# Altium schematic sheet 5V_to_3v3_LDO.SchDoc
size A4; SheetNumber: 1; SheetTotal: 1; SPICEModelCacheJSIICOIN: <root> / <DocumentId>JSIICOIN</DocumentId> / <CacheFrame Number="0"> / <Model Name="tps79301_trans" Kind="CKT"> / <Text>**$ENCRYPTED_LIB / **$INTERFACE / * PSpice Model Editor - Version 16.2.0 / *$ / * TPS79301 / ***************************************************************************** / * (C) Copyright 2014 Texas Instruments Incorporated. All rights reserved. / ***************************************************************************** / ** This model is designed as an aid for customers of Texas Instruments. / ** TI and its licensors and suppliers make no warranties, either expressed / ** or implied, with respect to this model, including the warranties of / ** merchantability or fitness for a particular purpose. The model is / ** provided solely on an "as is" basis. The entire risk as to its quality / ** and performance is with the customer / ***************************************************************************** / * / ** Released by: WEBENCH Design Center, Texas Instruments Inc. / * Part: TPS79301 / * Date: 15MAR2014 / * Model Type: Transient / * Simulator: PSPICE / * Simulator Version: 16.2.0.p001 / * EVM Order Number: / * EVM Users Guide:SLVU060A / * Datasheet:SLVS348K-JULY 2001-REVISED OCTOBER 2007 / * / * Model Version: Final 1.00 / * / ***************************************************************************** / * / * Updates: / * / * Final 1.00 / * Release to Web / * / ***************************************************************************** / .SUBCKT TPS79301_TRANS  EN FB IN NR OUT GND / $CDNENCSTART / eee8c5c7a2bc4b01f045f303678664e7916da0bae22e8cb0bba041dd67c69ce448ea70148a9ac1670c8926c1ac5057c8ccfcd77bf87ca9dc19aba5d812fba493 / e83d563d614d5ce9e51c6191fdee4cd4bce2d2dc11b96d0f837145b8adc33a658601dbab3ff30b84da2786fb28e183da6e95518d223f2ab2788d9cae4bb17f9a / 705d459f50f7a08caf1922b60cad7ad54cb34a6f6f4f982a83463dd640f012e5fa5c51fb57f6720834a9ff988247e80f7ceed9c0dd1315b72a5cba85944eb4fa / a5d158a0fc11634f706b807646b80371c9da099ce416dcb0d32ee1f27e0d56e381a4e64a33303cd14d5f52b18455b172772a154286059e76b1f4ddde2fe1d73b / 69ff18044fae7c89706b807646b8037173658656f6f1dced3d1d674018caacf76620fcb51151ae8a7f84b3e8dbca604066f166a62e9bfcac9633a999d416b399 / 1ac3d64a7ec42565706b807646b80371149ac564803ab67fc1c637a7619feb26064adbd3d20689e2cb54280b4e1f8a033c858dbd7e6e5120e4e72beed32b1f99 / 5911b2e9db27761730769f98cd129b1534a9ff988247e80f7ceed9c0dd1315b7d1a8fcda4803698e63ad4c3b7449453463c00aabea44dc2dd8dcbfbde6d9d2b2 / bbf0a766f49a242c2637e9cac2aa5cea2cecad1ebf804c4b2473511ee33aa3b97f84b3e8dbca604066f166a62e9bfcac2681eeb8fe6ce8909bec96d9b1f39191 / e9f419af62bfe95ecc0121b5e20e2076c72e677679789a89508e95ff7173491c9f7df7e1d8537137763d73e9d3a8d5e0dfe5c6a8bc6238bfe91723734fcf8610 / 0a74212461f65cb92e1bbe5dba9805b5cb82e1066e82af78661c6c5a6c3f664f7f84b3e8dbca604066f166a62e9bfcac2681eeb8fe6ce8909bec96d9b1f39191 / bc8ee2299b220803f4a59b3893f03200ff7f90e051f04fa3cf5e9389f2a48e3c7f84b3e8dbca604066f166a62e9bfcac2681eeb8fe6ce8909bec96d9b1f39191 / 22cc75479b3d980a706b807646b80371c9da099ce416dcb0978b3e87ef4193663a8d0e744922d2c29852d44347c77c30837145b8adc33a65e6b6ba3aa6ec6201 / b67df0d3ab862a12706b807646b80371a847f3fb487c186c2540f1cdf312432e38c6f7c0919fa89e895af9f8637e0b054c7da58466c8bc556bf82ac41d60ddb9 / 82d2e7992b7a58af706b807646b80371629b419ea2176fe19cdab920125b3b0b4fae28fee4ef20eda234819baa546b2d3c858dbd7e6e5120e4e72beed32b1f99 / 5911b2e9db27761730769f98cd129b1534a9ff988247e80f7ceed9c0dd1315b7d1a8fcda4803698e63ad4c3b7449453463c00aabea44dc2dd8dcbfbde6d9d2b2 / bbf0a766f49a242c2637e9cac2aa5cea2cecad1ebf804c4b2473511ee33aa3b97f84b3e8dbca604066f166a62e9bfcac2681eeb8fe6ce8909bec96d9b1f39191 / a78fdcc1e2fc2ea7706b807646b8037138b4be0d5687a202906c9da49022baf464ec8735ef2365027f84b3e8dbca604066f166a62e9bfcac9633a999d416b399 / 6dcc2999c2dfe559706b807646b8037116e82cf2888b8d42df328714255803be9d49d228ff1c35a97f84b3e8dbca604066f166a62e9bfcac9633a999d416b399 / cc09709c562a8286706b807646b803719b13369b7ab3a76d070cce7e9ba7f2819d49d228ff1c35a97f84b3e8dbca604066f166a62e9bfcac9633a999d416b399 / a3ce589fda26bc39706b807646b8037163d1ebe60620f47a8ff84965ac0438988f1d0e3b3309a7493ecfb4feaf868f207016d897b1fcb842011b26c00a24ed3e / 1e36f10390632b7b706b807646b8037188f237f17078bb3e5828604f05b2247e7f0d6b2739374f9a146c7f47970ca091ac6a06391c26b0c6a2c852a1a470e0c8 / ef66f270e2da7d19895af9f8637e0b054c7da58466c8bc5523245927d1d33062dcf8aa2e87681d7deb8cf60c52de5115f8d3bb9a1e85f46e5237270a1b7dd1f5 / 0be1bd08545f4ec3706b807646b8037181aec34a846648c936d94eb09baaf9df6d8b6f7aefd712bef624e8c395c7953e458652afce4c2b4691704ae041712f62 / f28257b2a3730294706b807646b80371a847f3fb487c186c17a64369f383dec138c6f7c0919fa89e895af9f8637e0b054c7da58466c8bc556bf82ac41d60ddb9 / e9f419af62bfe95ec12e63f53fc8b6c78fa97f4081b734eb6f7b98e75b088b137208a85e1aefd30afd26cf39ee84f7371c24f6ba9167be45e0e2c091faf9c017 / c7fe06de5e08df98fa85898f9d6a90d37016d897b1fcb842579634556de118d3d0bcbc1a7336c5bb89382ec530cb82307557875abc0067638338d63a883db422 / 73fa51df7509a51fb0f7aab853272d58b1cfb33a71c1795d6d8b6f7aefd712bef624e8c395c7953e458652afce4c2b469aa0e1271a91bceb873a87baeb61fd8c / e9f419af62bfe95ebc27f931268b4061c72e677679789a8974763235dc81d091f182b98fc749cfc2ab6a91e907f651e2fe9c0a56ac1647d141afa6f56cb94681 / 5d078000650a8fa5c3773be6f632e249608c60e84e4520dde1f45a68d1f752347016d897b1fcb842579634556de118d3d0bcbc1a7336c5bbab4caa7e4fa836d9 / 54653036f112a7e5706b807646b803719635ee95ea00d51c639842384662cfe1c2f5e47a2422c1148c0fab00abef36a96d8b6f7aefd712bee34600cbba4a4877 / 717cdf892ff6b6ffd811871cc3622e4a53e7b7d7fd04c659837145b8adc33a658601dbab3ff30b84da2786fb28e183da6e95518d223f2ab2788d9cae4bb17f9a / 615a28c46d72374094fbbbfac28a5c5c164c9e232793a5b063d9d49533be6e3aa645aa244bed3cbcae057debec93ce1d30068098b21db3ba98bfc394d84b4e3e / b0eb42ca922cce592fbfcc2b872ff946a30c69f2ad0860c8ce5ec34e6f8ad1cacef2f7fd91539e10d08d9c941a16e1242de074fb35dc5ff0f678c267c84f2c19 / 6fb17b3e36cbc8d0229f77bd6f2e3b704d5f52b18455b172772a154286059e76b71416234b0c4f764eb199a18f9439a2aee8bd433781f0d21305efc6b839f9d1 / 93d3808648446fd760c210771409cb2e74bc4f0599bfbbf3fac9e34ff9a2b15c7016d897b1fcb842579634556de118d3d0bcbc1a7336c5bbab4caa7e4fa836d9 / c9df73872fc60450dcf3cb9f8e545a358ef4fb8460dd04fc9db6a220404e57e927b418e572b2f76f895af9f8637e0b054c7da58466c8bc556bf82ac41d60ddb9 / 9afa1f10a7f457ea7674bbc8caf0d23de7a7ac7d39c4b64faed41d0d06901c48a1e767c240191cfd6d8b6f7aefd712bef624e8c395c7953e243395eb54001472 / e0bee0f3fadd672460c210771409cb2e9e85c7d75c3b3f87dc1c366bd83c65f7383e44ab7bc2ec26d76c198cda145e6a895af9f8637e0b05d8a7de0eb0ad615a / b90e0c5fe970b38760c210771409cb2e92fe7f16cd97a385f24bf58ddadd36c74b84da9a526f50928996186a7016e011a024153f06be8db3d8c31ae951a228f7 / 2cfd781695004e38a3f399af3dac7795bb29d99f46d30193d60191a00d46163e3d426b7882f492b6a2ad4bc1ed03fce043276e402e9ee7d697ba4aed923cec82 / 8aff843b323862a2fa8d7d0a82c540ac837145b8adc33a658601dbab3ff30b84da2786fb28e183da6e95518d223f2ab28953c1d5ac6e81dcf3a2b64f46f19475 / 5b7d7f52b30d443712142aa2ee180ddfd9cb3ab61e0099a420a3aa024657d8ca2948dbca19bbe739ec77872822f4abed85d11b62efb9c9729217e85dfd503ab0 / $CDNENCFINISH / .ENDS  TPS79301_TRANS</Text> / </Model> / </CacheFrame> / </root>
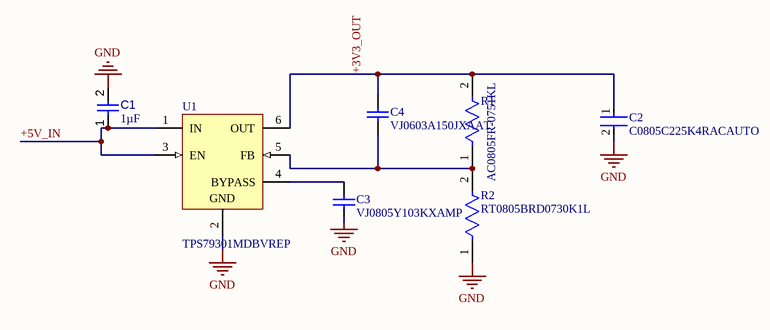
[diagram p0: 5V_to_3v3_LDO.SchDoc]

## Parts
C1  value 1µF  [CAPC2013X145X50ML20T25]  (hidden comment: Capacitor 1 uF +/- 10% 25 V 0805)
C2  C0805C225K4RACAUTO  [FP-C0805C225K4RACAUTO-MFG]
C3  VJ0805Y103KXAMP  [CAPC2013X145X48LL20T23]
C4  VJ0603A150JXAAT  [CAPC1608X92X38NL15T08]
R1  AC0805FR-0751KL  [FP-AC0805-MFG]
R2  RT0805BRD0730K1L  [FP-RT0805-MFG]
U1  TPS79301MDBVREP  [DBV0006A_L]

## Nets
GND: C1.2 C2.2 C3.2 R2.1 U1.2(GND)
+3V3_OUT: C2.1 C4.1 R1.2 U1.6(OUT)
+5V_IN: C1.1 U1.1(IN) U1.3(EN)
NetC3_1: C3.1 U1.4(BYPASS)
NetC4_2: C4.2 R1.1 R2.2 U1.5(FB)

## Library data of the parts
C1 = CMP-001-00010-6: Chip Capacitor, 1 uF, +/-10%, 25 V, 0805 (2012 Metric); Capacitor Type: Ceramic; Voltage Rating: 25V; RoHS Compliant: True; Pins: 2; Mounting Technology: SM; Max Operating Temperature: 125°C; Min Operating Temperature: -55°C; Tolerance: 10%; Case/Package: 0805
C2 = CMP-2007-03267-2: CAP CER 2.2UF 16V X7R 0805; Tolerance: 10%; Dielectric Material: Ceramic; Packaging: Cut Tape; Depth: 1.25mm; Package Quantity: 1; Case Code (Imperial): 0805; Contact Plating: Tin; REACH SVHC: No SVHC; Case/Package: 0805; Max Operating Temperature: 125°C; Thickness: 0.055inch; Height: 1.25mm; Mount: Surface Mount; Min Operating Temperature: -55°C; Construction: Flat; Series: C; Radiation Hardening: No; Capacitance: 2.2uF; Dielectric: X7R; Case Code (Metric): 2012; Length: 0.079inch; RoHS Compliant: Yes; Width: 0.049inch; Voltage Rating: 16V; Voltage Rating (DC): 16V; Ratings: AEC-Q200; Value: 2.2uF
C3 = CMP-2007-03159-1: Manufacturer: Vitramon; Part Number: VJ0805Y103KXAMP
C4 = CMP-2006-01455-1: Manufacturer: Vitramon; Part Number: VJ0603A150JXAAT
R1 = CMP-03412-037324-1: RES SMD 51K OHM 1% 1/8W 0805; Manufacturer: Yageo; Voltage Rating: 150V; Automotive Grade: Grade 0; Resistance: 51KΩ; Tolerance: 0.01; Value: 51KΩ; Device Class L3: Chip SMD Resistors; Category: Res; Composition: Thick Film; Device Class L1: Passive Components; ComponentLink2Description: Datasheet; Manufacturer Part Number: AC0805FR-0751KL; Temperature: -55°C to +155°C; Height: 0.6mm; Package: AC0805; ComponentLink2URL: http://www.yageo.com/documents/recent/PYu-AC_51_RoHS_L_6.pdf; Mouser Description: Thick Film Resistors - SMD 1/8W 51K ohm 1%; Lead Free: Yes; Digikey Description: RES SMD 51K OHM 1% 1/8W 0805; RoHS: TRUE; Device Class L2: Resistors; Octopart: https://octopart.com/ac0805fr-0751kl-yageo-24874955; Ipc Land Pattern Name: RESC200125X50; Temperature Range Low: -55°C; Footprint Url: http://www.yageo.com/exep/pages/download/literatures/PYu-R_Mount_10.pdf; Series: AC; Automotive: Yes; Power Rating: 1/8W; Temperature Range High: +155°C
R2 = CMP-2001-01484-2: RES SMD 30.1K OHM 0.1% 1/8W 0805; Manufacturer: Yageo; Temperature Coefficient: 25 ppm/°C; Value: 30.1KΩ; Tolerance: 0.0025; Voltage Rating: 150V; Power Rating: 0.125W; Composition: Thin Film; Automotive: No; Package: RT0805; Device Class L3: Chip SMD Resistors; Octopart: https://octopart.com/rt0805brd0730k1l-yageo-1452498; Series: RT; Temperature: -55°C to +155°C; ComponentLink2Description: Datasheet; Lead Free: Yes; Ipc Land Pattern Name: RESC200125X50; Footprint Url: http://www.yageo.com/exep/pages/download/literatures/PYu-R_Mount_10.pdf; Device Class L1: Passive Components; Manufacturer Part Number: RT0805BRD0730K1L; Resistance: 30.1KΩ; Device Class L2: Resistors; ComponentLink2URL: http://www.yageo.com/documents/recent/PYu-RT_1-to-0.01_RoHS_L_9.pdf; Temperature Range High: +155°C; RoHS: TRUE; Temperature Range Low: -55°C; Digikey Description: RES SMD 30.1K OHM 0.1% 1/8W 0805; Category: Res; Height: 0.6mm; Mouser Description: Thin Film Resistors - SMD 1/8W 30.1K ohm .1% 25ppm
U1 = CMP-0394-00788-2: Single Output Fast RF LDO, 200 mA, Adjustable 1.2 to 5.5 V Output, 2.7 to 5.5 V Input, 6-pin SOT-23 (DBV), -55 to 125 degC, Green (RoHS & no Sb/Br); Manufacturer: Texas Instruments; Accuracy(%): 2; SubFamily: Single Channel LDO; Rating: HiRel Enhanced Product; Vout Adj(Max)(V): 5.5; Iout(Max)(A): 0.2; Vin(Min)(V): 2.7; Vdo(Typ)(mV): 112; Vout Adj(Min)(V): 1.2; ComponentLink2URL: http://www.ti.com/general/docs/lit/getliterature.tsp?genericPartNumber=TPS79301-EP&fileType=pdf; DatasheetVersion: SGLS163B; Mounting Technology: Surface Mount; ComponentLink2Description: Datasheet; ComponentLink1URL: http://www.ti.com/; PackageDescription: 6-Pin Plastic Small Outline, Body 1.60 Ãƒâ€” 2.90 mm, Pitch 0.95 mm; Code_JEDEC: MO-178; Iq(Typ)(mA): 0.2; Vin(Max)(V): 5.5; PackageVersion: 4073253-5/K; Eco-Plan: Green (RoHS & no Sb/Br); ComponentLink1Description: Manufacturer URL; ComponentLink3Description: Package Specification; ComponentLink3URL: http://www.ti.com/litv/pdf/mpds026h; PackageReference: DBV0006A; PartNumber: TPS79301MDBVREP